# EAGLE design leaf-heater-controller-rev1 (EAGLE 9.0.0)
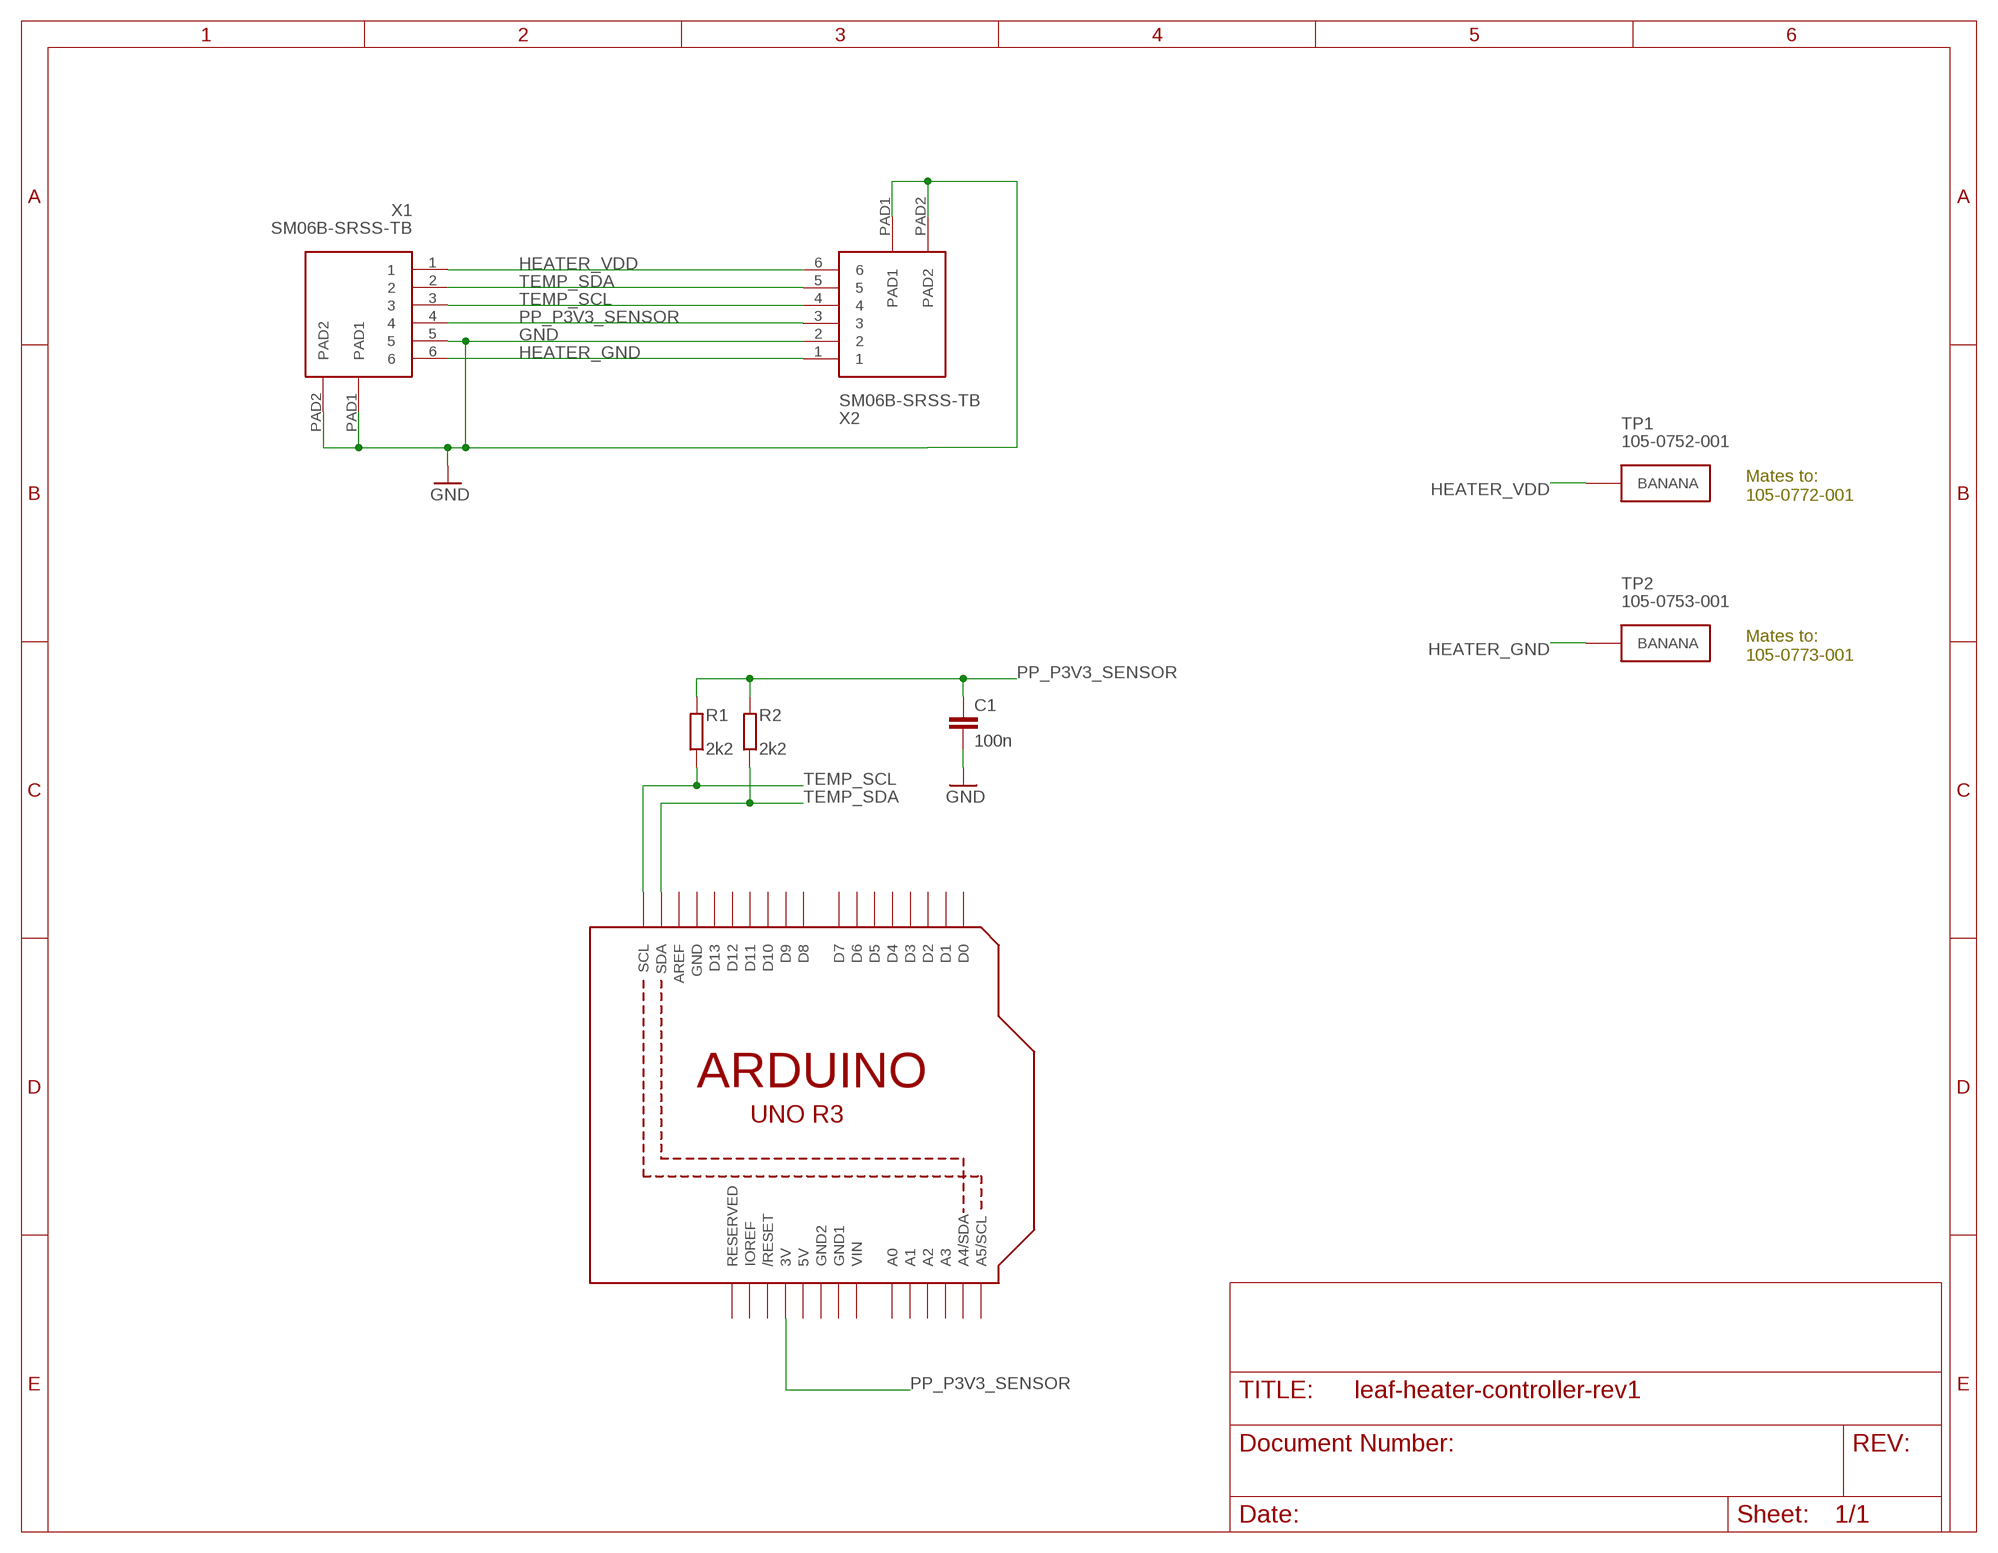
[diagram p0: schematic, sheet 1]

## Parts
C1  100n  C-EUC0603  [C0603]
R1  2k2  R-EU_R0603  [R0603]
R2  2k2  R-EU_R0603  [R0603]
TP1  105-0752-001  CINCH-BANANA  [CINCH-BANANA-105-075X-001]
TP2  105-0753-001  CINCH-BANANA  [CINCH-BANANA-105-075X-001]
U1  ARDUINOR3-DIMENSION  [ARDUINOR3]
X1  SM06B-SRSS-TB  JST-SH-6PIN  [JST-SM06B-SRSS-TB]
X2  SM06B-SRSS-TB  JST-SH-6PIN  [JST-SM06B-SRSS-TB]

## Nets
GND: C1.2 X1.5 X1.PAD1 X1.PAD2 X2.2 X2.PAD1 X2.PAD2
HEATER_GND: TP2.1(BANANA) TP2.2(BANANA) X1.6 X2.1
HEATER_VDD: TP1.1(BANANA) TP1.2(BANANA) X1.1 X2.6
PP_P3V3_SENSOR: C1.1 R1.2 R2.2 U1.3V X1.4 X2.3
TEMP_SCL: R1.1 U1.SCL X1.3 X2.4
TEMP_SDA: R2.1 U1.SDA X1.2 X2.5
Unconnected: U1.A0 U1.A1 U1.A2 U1.A3 U1.A4(A4/SDA) U1.A5(A5/SCL) U1.AREF U1.D0 U1.D1 U1.D2 U1.D3 U1.D4 U1.D5 U1.D6 U1.D7 U1.D8 U1.D9 U1.D10 U1.D11 U1.D12 U1.D13 U1.IOREF U1.RESERVED U1.RESET(/RESET)

## Notes on the sheet
- Mates to:
  105-0772-001
- Mates to:
  105-0773-001

## Power pins joined to a net without a drawn wire
5V: U1.5V
GND: U1.GND
GND1: U1.GND1
GND2: U1.GND2
VIN: U1.VIN

## Library data of the parts
C1 = rcl-modified-footprints:C-EU: CAPACITOR, European symbol
R1 R2 = rcl-modified-footprints:R-EU_: RESISTOR, European symbol
TP1 TP2 = meng-plant-raman:CINCH-BANANA; VALUE: 105-075X-001
U1 = adafruit:ARDUINOR3: This is a new object for the new Arduino R3 - with extra pins that you may want to use (such as IOref, and duplicated A4/A5
X1 X2 = meng-plant-raman:JST-SH-6PIN

## Board
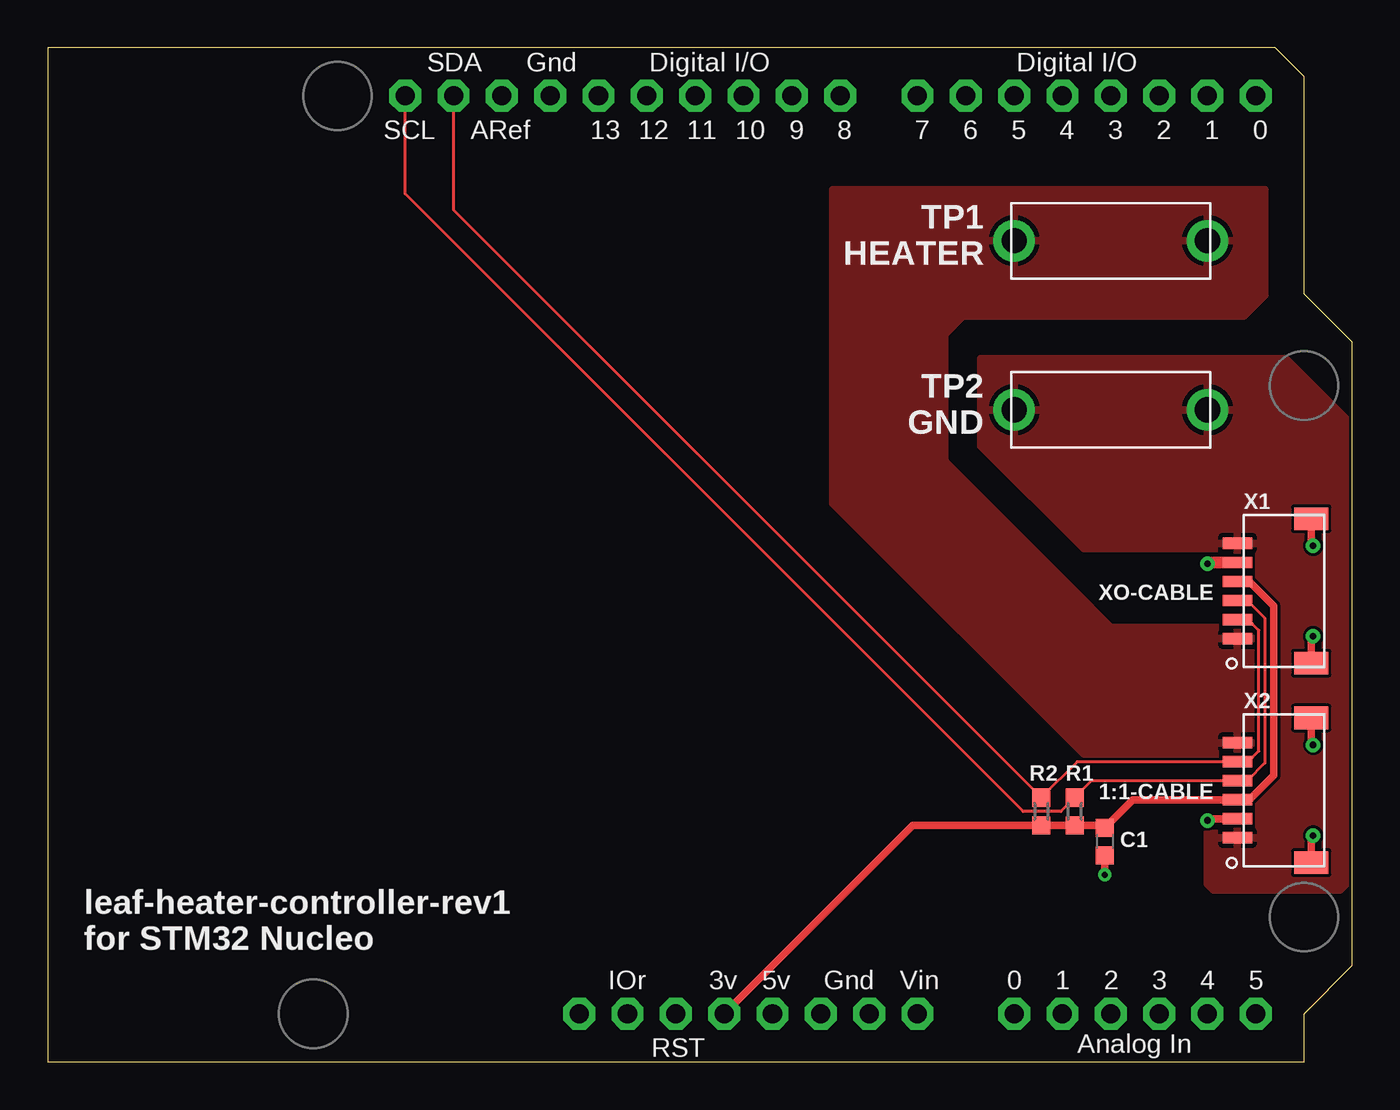
[diagram p1: board, top side]
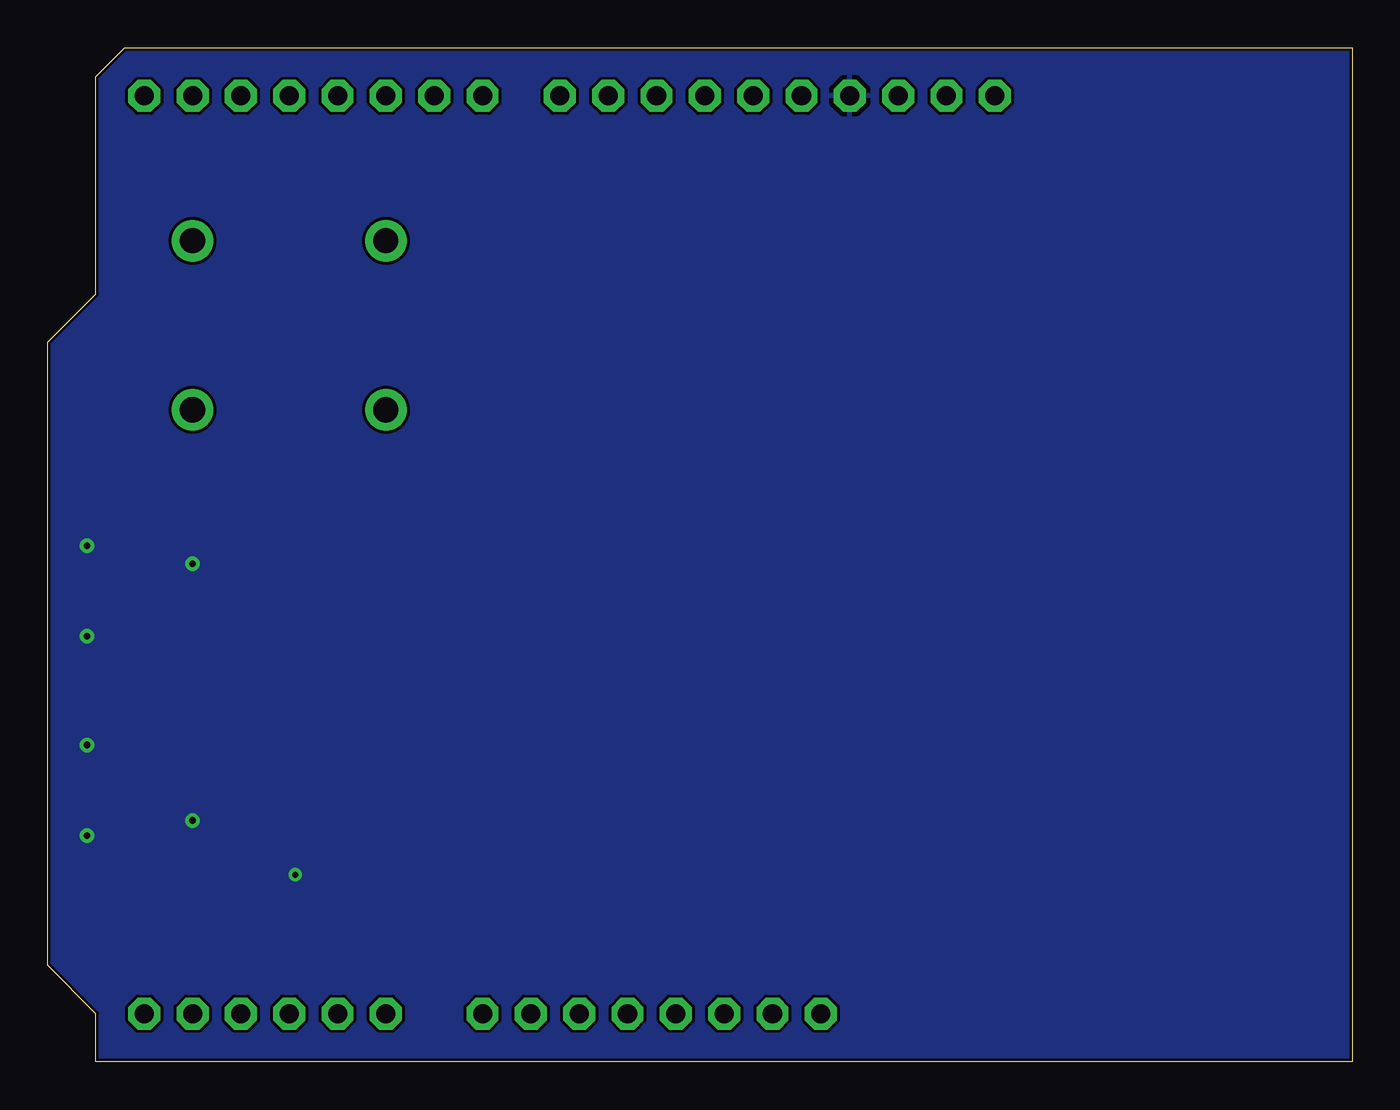
[diagram p2: board, bottom side, seen from below]

Size 68.58 x 53.34 mm. Coordinates in mm from the lower left corner, seen from the top.
Copper layers (1*16): Top 0.035mm / dielectric 1.5mm / Bottom 0.035mm
Design rules "default *": minimum track width 6mil, minimum drill 0.35mm, track to track 6mil, track to pad 6mil, pad to pad 6mil, via to via 6mil, smd to smd 6mil, copper to edge 6mil, drill to drill 6mil, minimum pad ring 10mil, minimum via ring 8mil, stop-mask expansion 4mil, vias tented up to drill 0mil, thermal gap 10mil

### Footprints (pad centres in the part's own frame; a part is rotated, then mirrored left to right if it is on the bottom)
C0603 = smd 0.95 x 0.95: 1 -0.725,0; 2 0.725,0
R0603 = smd 0.95 x 0.95: 1 -0.725,0; 2 0.725,0
CINCH-BANANA-105-075X-001 = drill 1.321 pad 2.184: 1 5.08,0; 2 -5.08,0
ARDUINOR3 = drill 1 pad 1.676 octagon: 3V 35.56,2.54; 5V 38.1,2.54; A0 50.8,2.54; A1 53.34,2.54; A2 55.88,2.54; A3 58.42,2.54; A4 60.96,2.54; A5 63.5,2.54; AREF 23.876,50.8; D0 63.5,50.8; D1 60.96,50.8; D2 58.42,50.8; D3 55.88,50.8; D4 53.34,50.8; D5 50.8,50.8; D6 48.26,50.8; D7 45.72,50.8; D8 41.656,50.8; D9 39.116,50.8; D10 36.576,50.8; D11 34.036,50.8; D12 31.496,50.8; D13 28.956,50.8; GND 26.416,50.8; GND1 43.18,2.54; GND2 40.64,2.54; IOREF 30.48,2.54; RESERVED 27.94,2.54; RESET 33.02,2.54; SCL 18.796,50.8; SDA 21.336,50.8; VIN 45.72,2.54
JST-SM06B-SRSS-TB = smd 0.6 x 1.55: 1 -2.5,4.775; 2 -1.5,4.775; 3 -0.5,4.775; 4 0.5,4.775; 5 1.5,4.775; 6 2.5,4.775 | smd 1.2 x 1.8: PAD1 3.8,0.9; PAD2 -3.8,0.9

### Placement (x,y rotation side)
C1  55.56,11.59 270 top
R1  53.98,13.18 270 top
R2  52.23,13.18 270 top
TP1  55.88,43.18 0 top
TP2  55.88,34.29 0 top
U1  0,0 0 top
X1  67.31,24.77 90 top
X2  67.31,14.29 90 top

### Tracks (layer width: path | path; a pad name or v marks a point on that pad's centre or on a via)
GND  (via drill 0.3, 0.35)
  Top 0.406: C1.2 v55.56,9.84 | v60.96,12.7 61.05,12.79 X2.2 | X2.PAD2 66.41,11.8 v66.52,11.91 | X2.PAD1 66.41,16.77 v66.52,16.67 | X1.PAD1 66.41,27.25 v66.52,27.15 | X1.PAD2 66.41,22.28 v66.52,22.38
  Top 0.61: X1.5 61.03,26.27 v60.96,26.19
  pour Bottom: 0,0 0,53.98 69.85,53.98 69.85,0
HEATER_GND
  pour Top: 49.05,36.99 65.09,36.99 68.58,33.5 68.58,9.68 67.94,9.05 61.28,9.05 60.96,9.37 60.96,12.06 64.61,15.72 64.61,24.13 61.75,26.99 54.45,26.99 49.05,32.38
HEATER_VDD
  pour Top: 63.98,45.72 63.98,40.32 62.87,39.21 62.71,39.21 48.1,39.21 47.15,38.26 47.15,31.59 53.82,24.92 55.88,22.86 63.66,22.86 63.66,16.19 54.45,16.19 41.59,29.05 41.27,29.37 41.27,45.24 41.27,45.88 63.98,45.88
PP_P3V3_SENSOR
  Top 0.406: U1.3V 45.47,12.45 R2.2 R1.2 55.42,12.45 C1.1 57.04,13.79 X2.3 63.16,13.79 64.45,15.08 64.45,23.97 63.16,25.27 X1.4
TEMP_SCL
  Top 0.152: U1.SCL 18.8,45.66 51.28,13.18 53.25,13.18 R1.1 54.86,14.79 X2.4 63.05,14.79 63.98,15.72 63.98,23.34 63.05,24.27 X1.3
TEMP_SDA
  Top 0.152: U1.SDA 21.34,44.79 R2.1 54.12,15.79 X2.5 63.09,15.79 63.66,16.35 63.66,22.7 63.09,23.27 X1.2

### Text on the board
tPlace: HEATER | GND | XO-CABLE | 1:1-CABLE | leaf-heater-controller-rev1 / for STM32 Nucleo